# EAGLE design M401B (EAGLE 6.6.0)
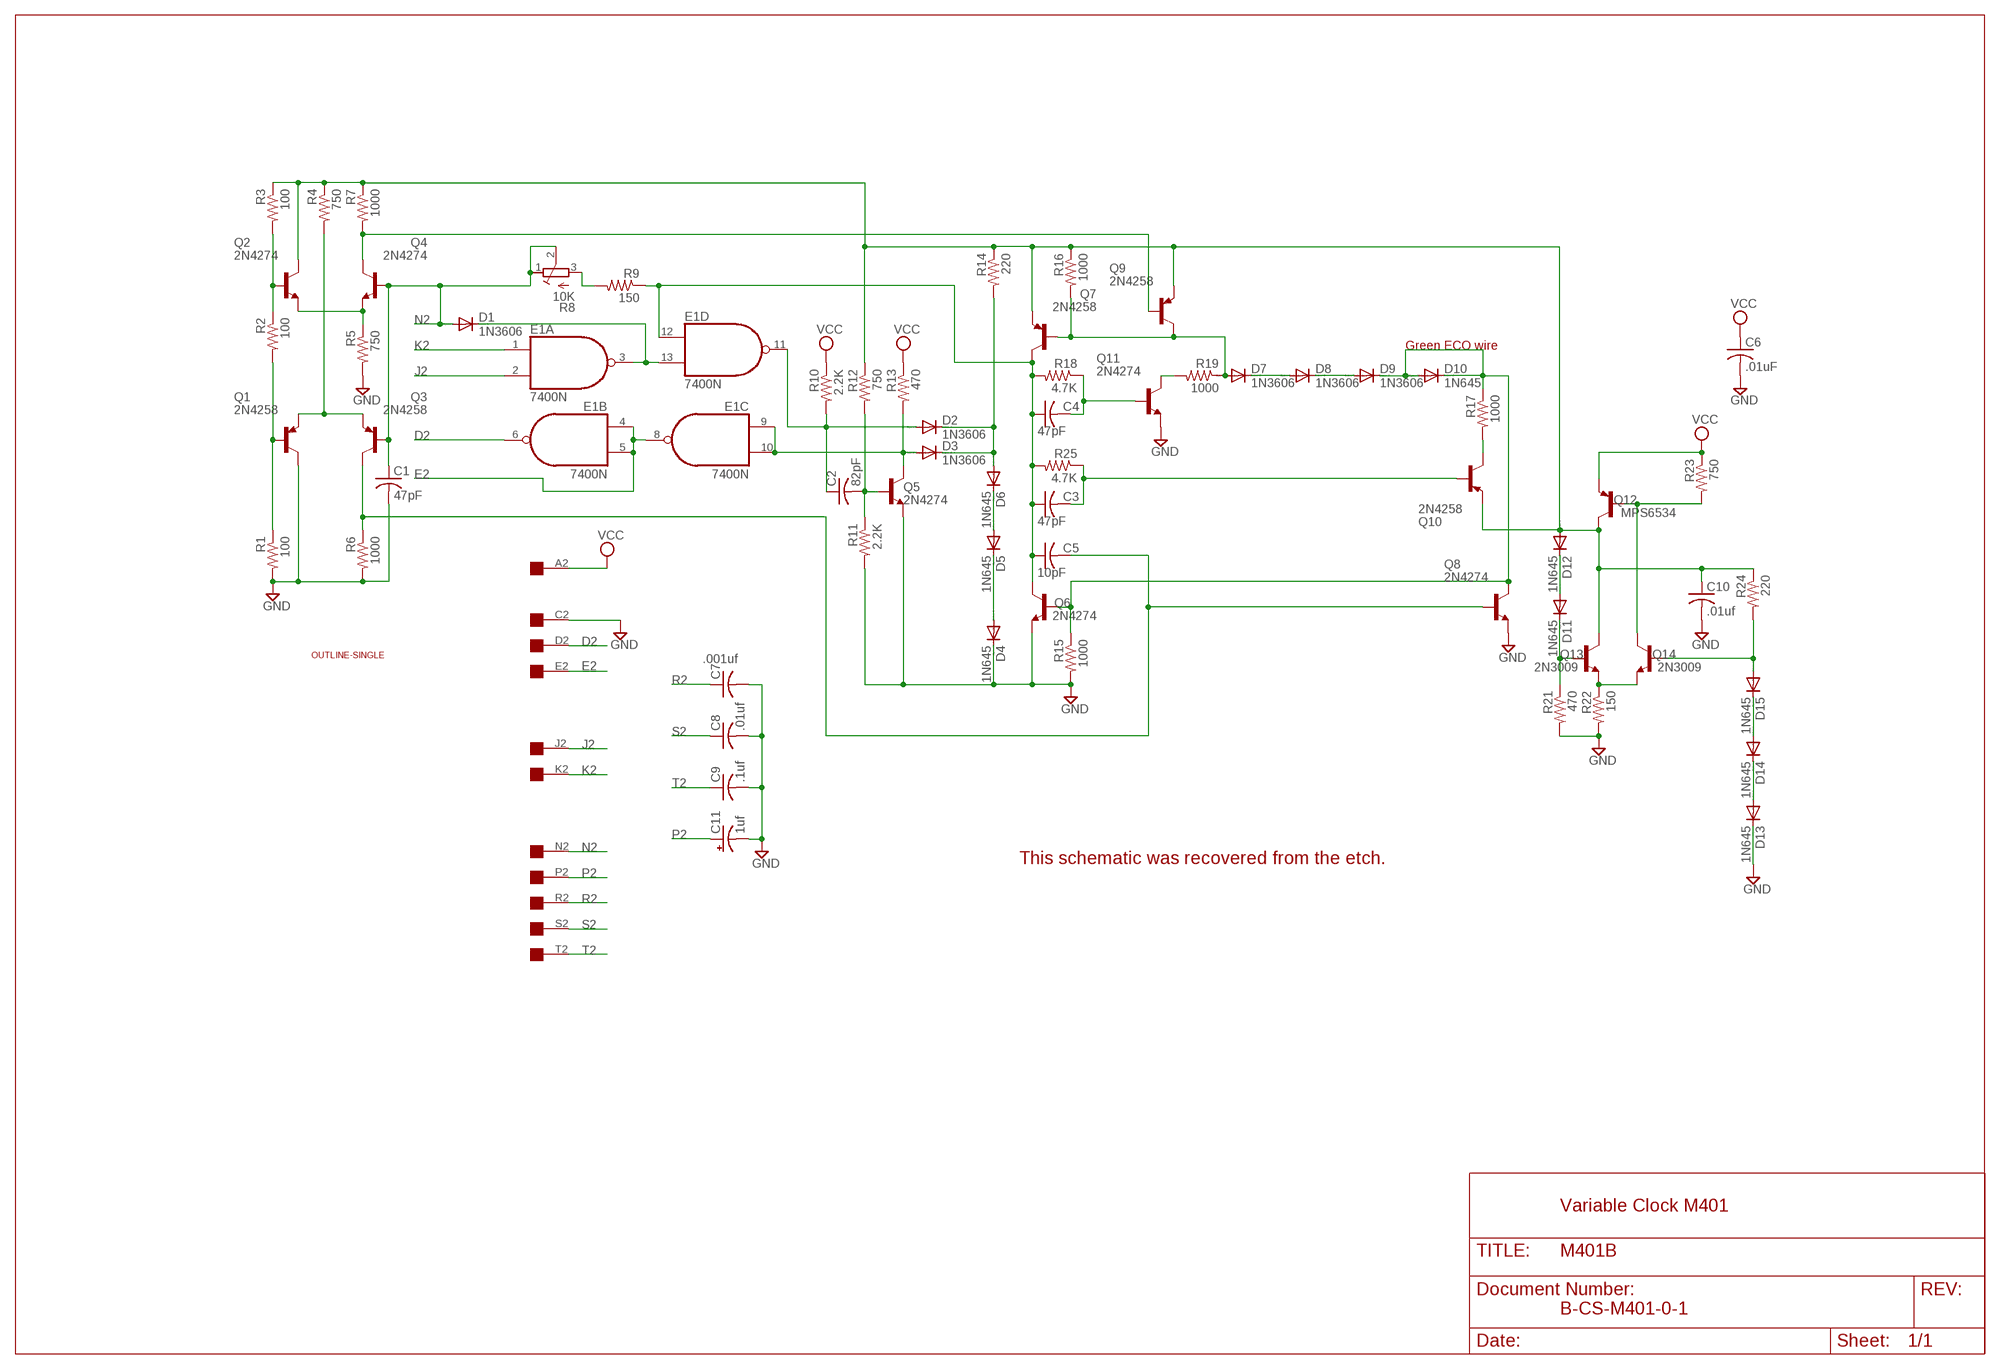
[diagram p0: schematic, sheet 1]

## Parts
C1  47pF  C-US050-025X075  [C050-025X075]
C2  82pF  C-US050-025X075  [C050-025X075]
C3  47pF  C-US050-025X075  [C050-025X075]
C4  47pF  C-US050-025X075  [C050-025X075]
C5  10pF  C-US225-062X268  [C225-062X268]
C6  .01uF  C-US050-025X075  [C050-025X075]
C7  .001uf  C-US050-025X075  [C050-025X075]
C8  .01uf  C-US225-062X268  [C225-062X268]
C9  .1uf  C-US275-093X316  [C275-093X316]
C10  .01uf  C-US050-025X075  [C050-025X075]
C11  1uf  CPOL-USE15-5AXIAL  [E15-5]
D1  1N3606  1N4148DO35-10  [DO35-10]
D2  1N3606  1N4148DO35-10  [DO35-10]
D3  1N3606  1N4148DO35-10  [DO35-10]
D4  1N645  1N4148DO35-10  [DO35-10]
D5  1N645  1N4148DO35-10  [DO35-10]
D6  1N645  1N4148DO35-10  [DO35-10]
D7  1N3606  1N4148DO35-10  [DO35-10]
D8  1N3606  1N4148DO35-10  [DO35-10]
D9  1N3606  1N4148DO35-10  [DO35-10]
D10  1N645  1N4148DO35-10  [DO35-10]
D11  1N645  1N4148DO35-10  [DO35-10]
D12  1N645  1N4148DO35-10  [DO35-10]
D13  1N645  1N4148DO35-10  [DO35-10]
D14  1N645  1N4148DO35-10  [DO35-10]
D15  1N645  1N4148DO35-10  [DO35-10]
E1  7400N  [DIL14]
Q1  2N4258  2N3637-PNP-TO39-EBC  [TO39]
Q2  2N4274  2N3019-NPN-TO39-EBC  [TO39]
Q3  2N4258  2N3637-PNP-TO39-EBC  [TO39]
Q4  2N4274  2N3019-NPN-TO39-EBC  [TO39]
Q5  2N4274  2N3019-NPN-TO39-EBC  [TO39]
Q6  2N4274  2N3019-NPN-TO39-EBC  [TO39]
Q7  2N4258  2N3637-PNP-TO39-EBC  [TO39]
Q8  2N4274  2N3019-NPN-TO39-EBC  [TO39]
Q9  2N4258  2N3637-PNP-TO39-EBC  [TO39]
Q10  2N4258  2N3637-PNP-TO39-EBC  [TO39]
Q11  2N4274  2N3019-NPN-TO39-EBC  [TO39]
Q12  MPS6534  2N3637-PNP-TO39-EBC  [TO39]
Q13  2N3009  2N3019-NPN-TO39-EBC  [TO39]
Q14  2N3009  2N3019-NPN-TO39-EBC  [TO39]
R1  100  R-US_0207/10  [0207/10]
R2  100  R-US_0207/10  [0207/10]
R3  100  R-US_0207/10  [0207/10]
R4  750  R-US_0207/10  [0207/10]
R5  750  R-US_0207/10  [0207/10]
R6  1000  R-US_0207/10  [0207/10]
R7  1000  R-US_0207/10  [0207/10]
R8  10K  275P  [3006Y]
R9  150  R-US_0207/10  [0207/10]
R10  2.2K  R-US_0207/10  [0207/10]
R11  2.2K  R-US_0207/10  [0207/10]
R12  750  R-US_0207/10  [0207/10]
R13  470  R-US_0207/10  [0207/10]
R14  220  R-US_0207/10  [0207/10]
R15  1000  R-US_0207/10  [0207/10]
R16  1000  R-US_0207/10  [0207/10]
R17  1000  R-US_0207/10  [0207/10]
R18  4.7K  R-US_0207/10  [0207/10]
R19  1000  R-US_0207/10  [0207/10]
R21  470  R-US_0207/10  [0207/10]
R22  150  R-US_0207/10  [0207/10]
R23  750  R-US_0207/10  [0207/10]
R24  220  R-US_0207/10  [0207/10]
R25  4.7K  R-US_0207/10  [0207/10]
U$1  OUTLINE-SINGLE  [SINGLE]
U$2  EDGE-1  [EDGE-CON1]

## Nets
D2: E1.6(B:O) U$2.D2
E2: E1.4(B:I0) E1.5(B:I1) E1.8(C:O) U$2.E2
GND [power]: C1.2 C6.2 C7.2 C8.2 C9.2 C10.2 C11.- D4.C D13.C Q1.3(C) Q5.1(E) Q6.1(E) Q8.1(E) Q11.1(E) R1.2 R5.2 R6.2 R11.2 R15.2 R21.2 R22.2 U$2.C2
J2: E1.2(A:I1) U$2.J2
K2: E1.1(A:I0) U$2.K2
N2: C1.1 D1.A Q3.2(B) Q4.2(B) R8.1(A) R8.2(S) U$2.N2
N$1: D14.A D15.C
N$2: D13.A D14.C
N$3: D15.A Q14.2(B) R24.2
N$4: Q12.2(B) Q14.3(C) R23.2
N$5: C10.1 D12.A Q2.3(C) Q7.1(E) Q9.1(E) Q10.1(E) Q12.3(C) Q13.3(C) R3.1 R4.1 R7.1 R12.1 R14.1 R16.1 R24.1
N$6: D11.C Q13.2(B) R21.1
N$7: Q13.1(E) Q14.1(E) R22.1
N$8: D11.A D12.C
N$9: R8.3(E) R9.2
N$10: Q1.2(B) R1.1 R2.2
N$11: D3.A E1.9(C:I0) E1.10(C:I1) Q5.3(C) R13.2
N$12: D1.C E1.3(A:O) E1.13(D:I1)
N$13: D4.A D5.C
N$14: D8.C D9.A
N$15: Q10.3(C) R17.2
N$16: D7.C D8.A
N$17: D9.C D10.A D10.C Q6.2(B) Q8.3(C) R15.1 R17.1
N$18: D7.A Q7.2(B) Q9.3(C) R16.2 R19.1
N$20: D5.A D6.C
N$21: C3.1 C4.1 C5.1 E1.12(D:I0) Q6.3(C) Q7.3(C) R9.1 R18.2 R25.2
N$23: C4.2 Q11.2(B) R18.1
N$24: Q11.3(C) R19.2
N$25: D2.C D3.C D6.A R14.2
N$27: C3.2 Q10.2(B) R25.1
N$28: C2.2 Q5.2(B) R11.1 R12.2
N$29: C5.2 Q3.3(C) Q8.2(B) R6.1
N$30: C2.1 D2.A E1.11(D:O) R10.2
N$32: Q1.1(E) Q3.1(E) R4.2
N$33: Q4.3(C) Q9.2(B) R7.2
N$34: Q2.2(B) R2.1 R3.2
N$35: Q2.1(E) Q4.1(E) R5.1
P2: C11.+ U$2.P2
R2: C7.1 U$2.R2
S2: C8.1 U$2.S2
T2: C9.1 U$2.T2
VCC [power]: C6.1 Q12.1(E) R10.1 R13.1 R23.1 U$2.A2
Unconnected: U$2.B2 U$2.F2 U$2.H2 U$2.L2 U$2.M2 U$2.U2 U$2.V2

## Notes on the sheet
- Green ECO wire
- This schematic was recovered from the etch.
- Variable Clock M401
- B-CS-M401-0-1

## Power pins joined to a net without a drawn wire
GND: E1.7(P:GND)
VCC: E1.14(P:VCC)

## Library data of the parts
C1-C10 = rcl:C-US: CAPACITOR, American symbol
C11 = rcl:CPOL-US: POLARIZED CAPACITOR, American symbol
D1-D15 = diode:1N4148: DIODE high speed (Philips)
E1 = 74xx-us:74*00: Quad 2-input NAND gate
Q1 Q3 Q7 Q9 Q10 Q12 = transistor:*-PNP-: PNP Transistror
Q2 Q4-Q6 Q8 Q11 Q13 Q14 = transistor:*-NPN-: NPN Transistror BF959 corrected 2008.03.06
R1-R7 R9-R19 R21-R25 = rcl:R-US_: RESISTOR, American symbol
R8 = dec-con:275P: Trimpot with 275P (3006Y) footprint.
U$1 = dec-con:OUTLINE-*: Board outlines for DEC boards.
U$2 = dec-con:EDGE-1: Single-Sided DEC Edge Connector -- (side 2)

## Net classes
1 power: width 0.813 mm

## Board
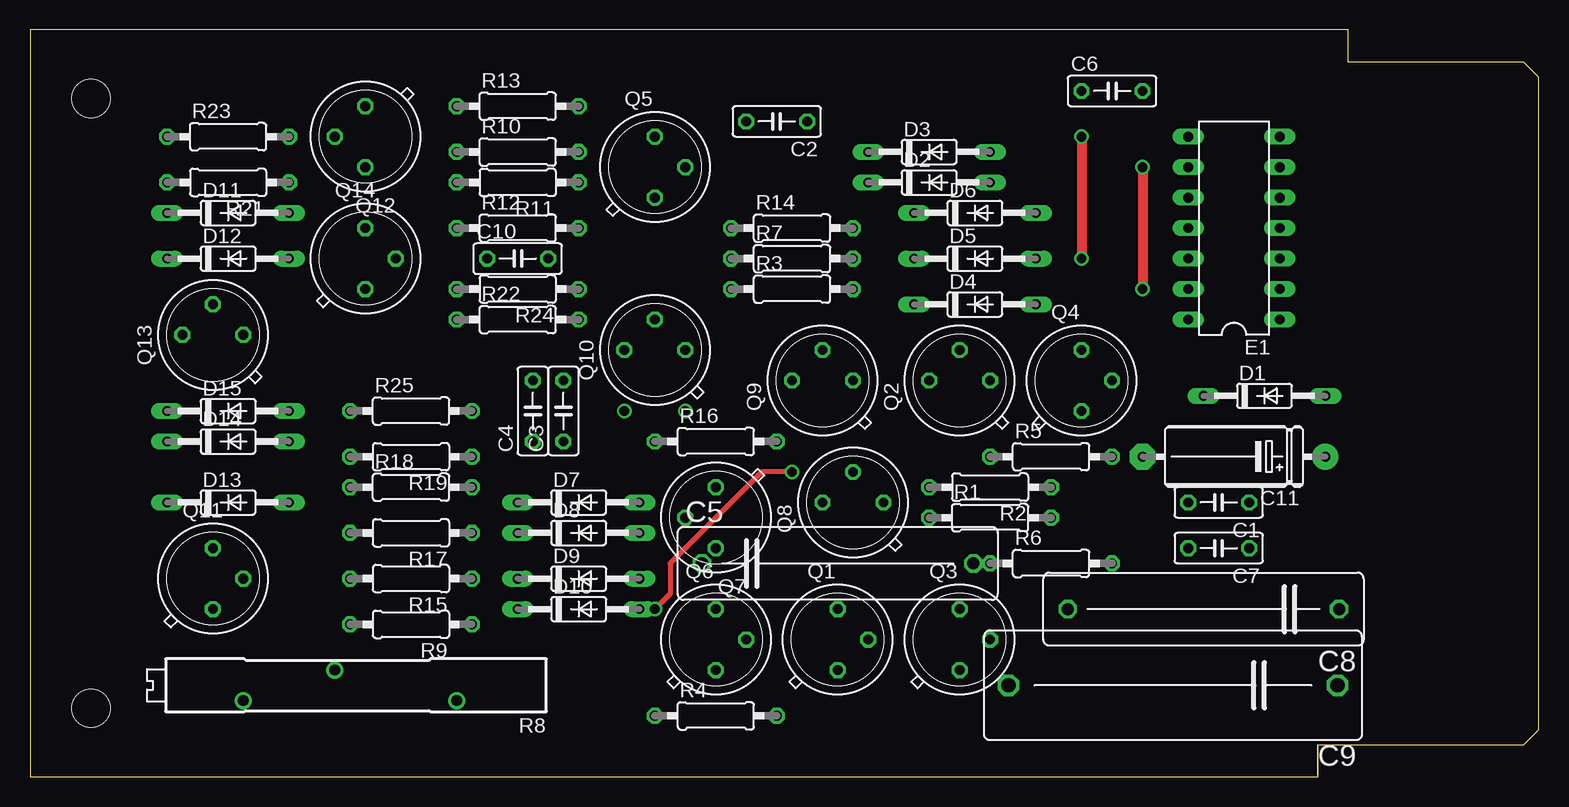
[diagram p1: board, top side]
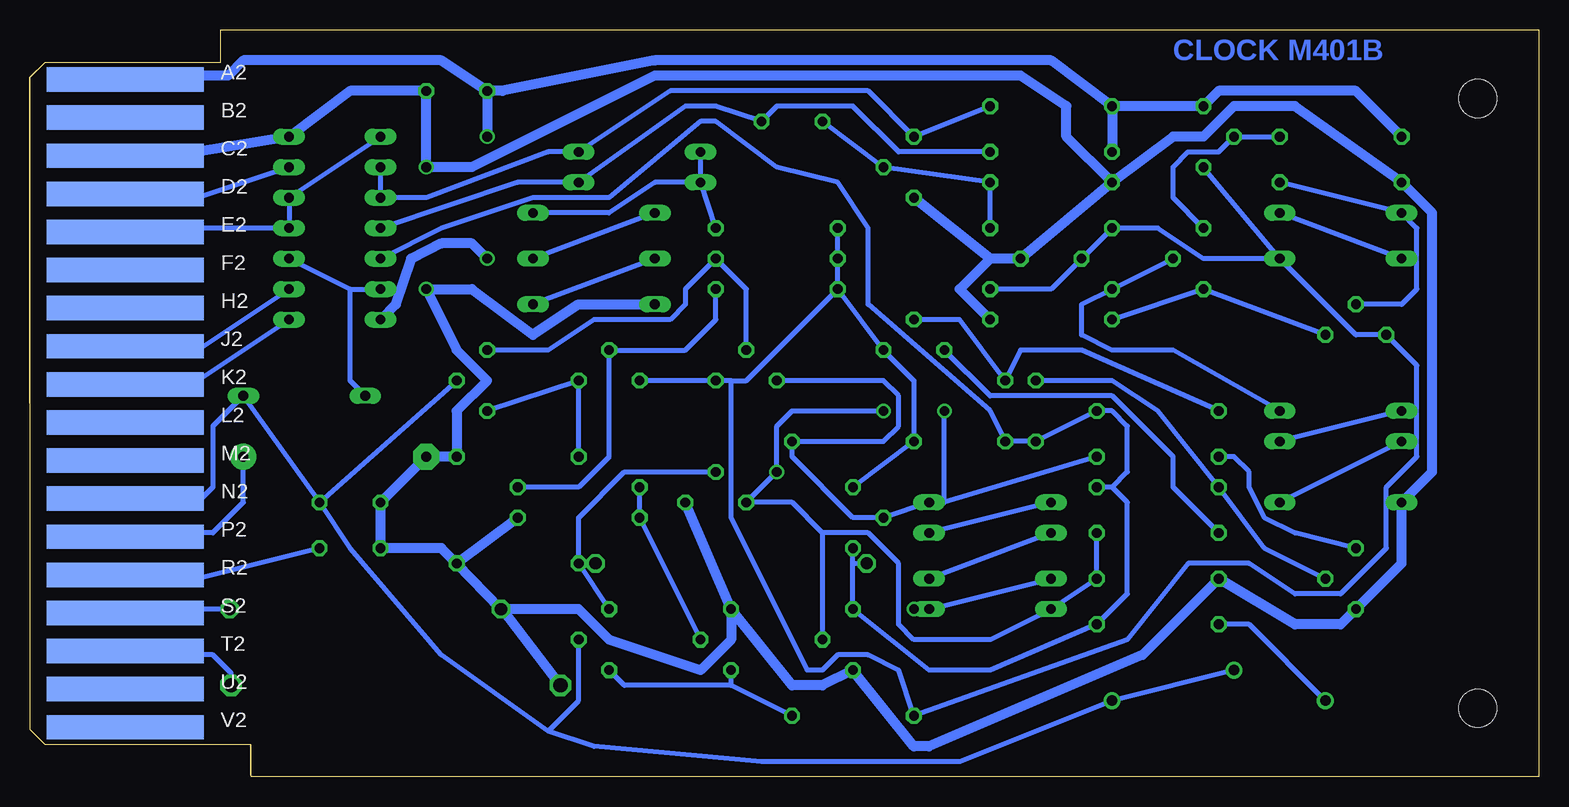
[diagram p2: board, bottom side, seen from below]

Size 125.73 x 62.23 mm. Coordinates in mm from the lower left corner, seen from the top.
Copper layers (1+16): Top 0.035mm / dielectric 1.5mm / Bottom 0.035mm
Design rules "16mils": minimum track width 16mil, minimum drill 32mil, track to track 15mil, track to pad 10mil, pad to pad 10mil, via to via 10mil, smd to smd 10mil, copper to edge 13mil, drill to drill 10mil, minimum pad ring 10mil, minimum via ring 8mil, stop-mask expansion 0mil, vias tented up to drill 0mil, thermal gap 10mil

### Footprints (pad centres in the part's own frame; a part is rotated, then mirrored left to right if it is on the bottom)
C050-025X075 = drill 0.813 octagon: 1 -2.54,0; 2 2.54,0
C225-062X268 = drill 1.016 octagon: 1 -11.303,0; 2 11.303,0
C275-093X316 = drill 1.194 octagon: 1 -13.716,0; 2 13.716,0
E15-5 = drill 0.813 pad 2.159: + -7.62,0 | drill 0.813 pad 2.159 octagon: - 7.62,0
DO35-10 = drill 0.813 long: A 5.08,0; C -5.08,0
DIL14 = drill 0.813 long: 1 -7.62,-3.81; 2 -5.08,-3.81; 3 -2.54,-3.81; 4 0,-3.81; 5 2.54,-3.81; 6 5.08,-3.81; 7 7.62,-3.81; 8 7.62,3.81; 9 5.08,3.81; 10 2.54,3.81; 11 0,3.81; 12 -2.54,3.81; 13 -5.08,3.81; 14 -7.62,3.81
TO39 = drill 0.813 octagon: 1 0,-2.54; 2 2.54,0; 3 0,2.54
0207/10 = drill 0.813 octagon: 1 -5.08,0; 2 5.08,0
3006Y = drill 0.9: 1 -8.89,1.27; 2 1.27,-1.27; 3 8.89,1.27
SINGLE = hole 3.175: 120.65,56.515; 120.65,5.715
EDGE-CON1 = smd 13.106 x 2.032 bottom: A2 7.938,4.128; B2 7.938,7.303; C2 7.938,10.477; D2 7.938,13.652; E2 7.938,16.828; F2 7.938,20.003; H2 7.938,23.177; J2 7.938,26.352; K2 7.938,29.527; L2 7.938,32.703; M2 7.938,35.877; N2 7.938,39.053; P2 7.938,42.227; R2 7.938,45.403; S2 7.938,48.578; T2 7.938,51.752; U2 7.938,54.928; V2 7.938,58.102

### Placement (x,y rotation side)
C1  99.06,22.86 180 top
C2  62.23,54.61 180 top
C3  44.45,30.48 90 top
C4  41.91,30.48 90 top
C5  67.31,17.78 0 top
C6  90.17,57.15 0 top
C7  99.06,19.05 180 top
C8  97.79,13.97 180 top
C9  95.25,7.62 180 top
C10  40.64,43.18 0 top
C11  100.33,26.67 180 top
D1  102.87,31.75 0 top
D2  74.93,49.53 0 top
D3  74.93,52.07 0 top
D4  78.74,39.37 0 top
D5  78.74,43.18 0 top
D6  78.74,46.99 0 top
D7  45.72,22.86 0 top
D8  45.72,20.32 0 top
D9  45.72,16.51 0 top
D10  45.72,13.97 0 top
D11  16.51,46.99 0 top
D12  16.51,43.18 0 top
D13  16.51,22.86 0 top
D14  16.51,27.94 0 top
D15  16.51,30.48 0 top
E1  100.33,45.72 90 top
Q1  67.31,11.43 0 top
Q2  77.47,33.02 90 top
Q3  77.47,11.43 0 top
Q4  87.63,33.02 0 top
Q5  52.07,50.8 0 top
Q6  57.15,11.43 0 top
Q7  57.15,21.59 180 top
Q8  68.58,22.86 90 top
Q9  66.04,33.02 90 top
Q10  52.07,35.56 90 top
Q11  15.24,16.51 0 top
Q12  27.94,53.34 180 top
Q13  15.24,36.83 90 top
Q14  27.94,43.18 0 top
R1  80.01,21.59 0 top
R2  80.01,24.13 180 top
R3  63.5,40.64 0 top
R4  57.15,5.08 0 top
R5  85.09,26.67 0 top
R6  85.09,17.78 0 top
R7  63.5,43.18 0 top
R8  26.67,7.62 180 top
R9  31.75,12.7 180 top
R10  40.64,52.07 0 top
R11  40.64,49.53 180 top
R12  40.64,45.72 0 top
R13  40.64,55.88 0 top
R14  63.5,45.72 0 top
R15  31.75,16.51 180 top
R16  57.15,27.94 0 top
R17  31.75,20.32 180 top
R18  31.75,24.13 0 top
R19  31.75,26.67 180 top
R21  16.51,49.53 180 top
R22  40.64,38.1 0 top
R23  16.51,53.34 0 top
R24  40.64,40.64 180 top
R25  31.75,30.48 0 top
U$1  125.73,62.23 180 top
U$2  125.73,62.23 180 top

### Tracks (layer width: path | path; a pad name or v marks a point on that pad's centre or on a via)
D2
  Bottom 0.406: U$2.D2 116.84,48.26 111.76,48.26 E1.6
E2
  Bottom 0.406: E1.8 E1.5 E1.4 116.84,45.72 U$2.E2
GND  (via drill 0.81)
  Top 0.813: v92.71,50.8 v92.71,40.64
  Bottom 0.813: U$2.C2 116.84,52.07 111.76,52.07 E1.7 99.06,57.15 C6.2 v92.71,50.8 88.9,50.8 73.66,58.42 43.18,58.42 39.37,55.88 39.37,53.34 R11.2 | 86.36,13.97 C8.2 90.19,17.76 | 86.36,13.97 C9.2 | 90.19,17.76 91.44,19.05 C7.2 C1.2 C11.- R5.2 90.17,30.48 87.63,33.02 90.17,35.56 v92.71,40.64 88.9,40.64 83.82,36.83 80.01,39.37 D4.C | 90.19,17.76 R6.2 R1.2 | R11.2 30.48,53.34 27.94,53.34 25.4,55.88 20.32,55.88 R21.2 8.89,46.99 8.89,25.4 D13.C 11.43,17.78 Q11.1 16.51,12.7 20.32,12.7 R15.2 33.02,10.16 50.8,2.54 52.07,2.54 Q6.1 59.69,7.62 62.23,7.62 Q1.3 | 45.72,43.18 C10.2 R11.2 | 45.72,43.18 Q5.1 | Q1.3 Q8.1 | Q1.3 67.31,11.43 69.85,8.89 77.47,11.43 80.01,13.97 86.36,13.97 | R22.2 48.26,40.64 45.72,43.18
J2
  Bottom 0.406: U$2.J2 116.84,35.56 111.76,35.56 E1.2
K2
  Bottom 0.406: U$2.K2 116.84,33.02 111.76,33.02 E1.1
N2
  Bottom 0.406: U$2.N2 116.84,22.86 111.76,22.86 110.49,24.13 110.49,29.21 D1.A C1.1 | C1.1 Q4.2 | Q3.2 80.01,6.35 82.55,3.81 | 82.55,3.81 91.44,10.16 99.06,19.05 C1.1 | R8.2 R8.1 48.26,1.27 64.77,1.27 78.74,2.54 82.55,3.81
N$1
  Bottom 0.406: D15.C D14.A
N$2
  Bottom 0.406: D14.C D13.A
N$3
  Bottom 0.406: Q14.2 R24.2 38.1,39.37 38.1,36.83 35.56,35.56 30.48,35.56 D15.A
N$4
  Bottom 0.406: R23.2 Q12.2 26.67,52.07 29.21,52.07 30.48,50.8 30.48,48.26 Q14.3
N$5
  Bottom 0.406: R14.1 R7.1 R3.1 | D12.A 15.24,36.83 Q13.3 10.16,34.29 10.16,26.67 12.7,24.13 12.7,19.05 16.51,15.24 20.32,15.24 24.13,17.78 29.21,17.78 34.29,11.43 R4.1 53.34,8.89 55.88,10.16 58.42,10.16 59.69,8.89 60.96,8.89 67.31,21.59 67.31,33.02 | D12.A Q12.3 | D12.A 27.94,43.18 31.75,45.72 R12.1 C10.1 40.64,40.64 R24.1 | Q2.3 Q9.1 67.31,33.02 | 67.31,33.02 66.04,33.02 R3.1 | R3.1 Q10.1 52.07,33.02 R16.1 Q7.1
N$6
  Bottom 0.406: R21.1 D11.C 10.16,45.72 10.16,40.64 11.43,39.37 Q13.2
N$7
  Bottom 0.406: Q13.1 Q14.1 R22.1
N$8
  Bottom 0.406: D12.C D11.A
N$9
  Bottom 0.406: R8.3 24.13,12.7 R9.2
N$10
  Bottom 0.406: R2.2 R1.1 Q1.2
N$11
  Bottom 0.406: E1.9 E1.10 92.71,48.26 82.55,52.07 D3.A 72.39,57.15 55.88,57.15 Q5.3 R13.2
N$12
  Bottom 0.406: 99.06,40.64 E1.13 99.06,40.64 | 99.06,40.64 E1.3 | D1.C 99.06,33.02 99.06,40.64
N$13
  Bottom 0.406: D5.C D4.A
N$14
  Bottom 0.406: D8.C D9.A
N$15
  Bottom 0.406: R17.2 30.48,24.13 30.48,26.67 35.56,31.75 45.72,31.75 Q10.3
N$16
  Bottom 0.406: D7.C D8.A
N$17  (via drill 0.81)
  Top 0.406: v63.5,25.4 60.96,25.4 53.34,17.78 53.34,15.24 v52.07,13.97
  Bottom 0.406: D9.C D10.A v52.07,13.97 | 59.69,20.32 Q6.2 | 59.69,20.32 62.23,22.86 Q8.3 v63.5,25.4 63.5,29.21 62.23,30.48 v54.61,30.48 | R17.1 R15.1 D10.C 45.72,11.43 52.07,11.43 53.34,12.7 53.34,17.78 55.88,20.32 59.69,20.32
N$18  (via drill 0.81)
  Bottom 0.406: Q9.3 54.61,33.02 53.34,31.75 53.34,29.21 54.61,27.94 R16.2 62.23,26.67 57.15,21.59 Q7.2 D7.A 49.53,22.86 | R19.1 49.53,22.86 | 49.53,22.86 v49.53,30.48
N$20
  Bottom 0.406: D6.C D5.A
N$21
  Bottom 0.406: E1.12 91.44,45.72 83.82,48.26 77.47,48.26 69.85,54.61 68.58,54.61 63.5,50.8 58.42,49.53 55.88,45.72 55.88,39.37 45.72,30.48 C3.1 C4.1 R25.2 35.56,30.48 34.29,29.21 34.29,25.4 35.56,24.13 | 57.15,17.78 Q6.3 50.8,8.89 45.72,8.89 R9.1 34.29,15.24 34.29,22.86 35.56,24.13 | 57.15,17.78 Q7.3 | 57.15,17.78 C5.1 | 35.56,24.13 R18.2
N$23
  Bottom 0.406: Q11.2 22.86,19.05 R18.1 31.75,30.48 35.56,33.02 C4.2
N$24
  Bottom 0.406: Q11.3 20.32,20.32 22.86,21.59 24.13,24.13 24.13,25.4 25.4,26.67 R19.2
N$25
  Bottom 0.406: D2.C D3.C | R14.2 D2.C | D6.A 77.47,46.99 73.66,49.53 D2.C
N$27
  Bottom 0.406: R25.1 38.1,35.56 43.18,35.56 C3.2 48.26,38.1 Q10.2
N$28
  Bottom 0.406: C2.2 Q5.2 R11.1 R12.2
N$29
  Bottom 0.406: Q3.3 R6.1 | Q8.2 76.2,25.4 80.01,21.59 R6.1 | R6.1 C5.2
N$30
  Bottom 0.406: E1.11 85.09,49.53 D2.A 71.12,55.88 68.58,55.88 C2.1 63.5,55.88 57.15,55.88 53.34,52.07 R10.2
N$32
  Bottom 0.406: Q3.1 76.2,7.62 67.31,7.62 | R4.2 67.31,7.62 | 67.31,7.62 Q1.1
N$33
  Bottom 0.406: Q4.3 82.55,35.56 78.74,38.1 72.39,38.1 71.12,39.37 71.12,40.64 R7.2 66.04,40.64 Q9.2
N$34
  Bottom 0.406: R3.2 68.58,38.1 71.12,35.56 Q2.2 77.47,26.67 80.01,24.13 R2.1
N$35
  Bottom 0.406: Q4.1 Q2.1 R5.1
P2
  Bottom 0.406: U$2.P2 116.84,20.32 110.49,20.32 107.95,22.86 C11.+
R2
  Bottom 0.406: U$2.R2 116.84,16.51 111.76,16.51 C7.1
S2
  Bottom 0.406: U$2.S2 116.84,13.97 C8.1
T2
  Bottom 0.406: U$2.T2 116.84,10.16 110.49,10.16 108.97,8.64 C9.1
VCC  (via drill 0.81)
  Top 0.813: v87.63,53.34 v87.63,43.18
  Bottom 0.813: U$2.A2 116.84,58.42 109.22,58.42 107.95,59.69 91.44,59.69 C6.1 | C6.1 v87.63,53.34 | v87.63,43.18 88.9,44.45 91.44,44.45 93.98,43.18 95.25,39.37 E1.14 | R13.1 40.64,59.69 73.66,59.69 86.36,57.15 C6.1 | R13.1 Q12.1 26.67,57.15 15.24,57.15 R23.1 | R13.1 R10.1

### Text on the board
Bottom: CLOCK M401B